# Altium schematic sheet MCU.SchDoc: MCU
size A4; ApprovedBy: Nhatkhongbuon; Author: Nhatkhongbuon; Revision: 1.0; SheetNumber: 2; SheetTotal: 3; ProjectTitle: Mobile Robot
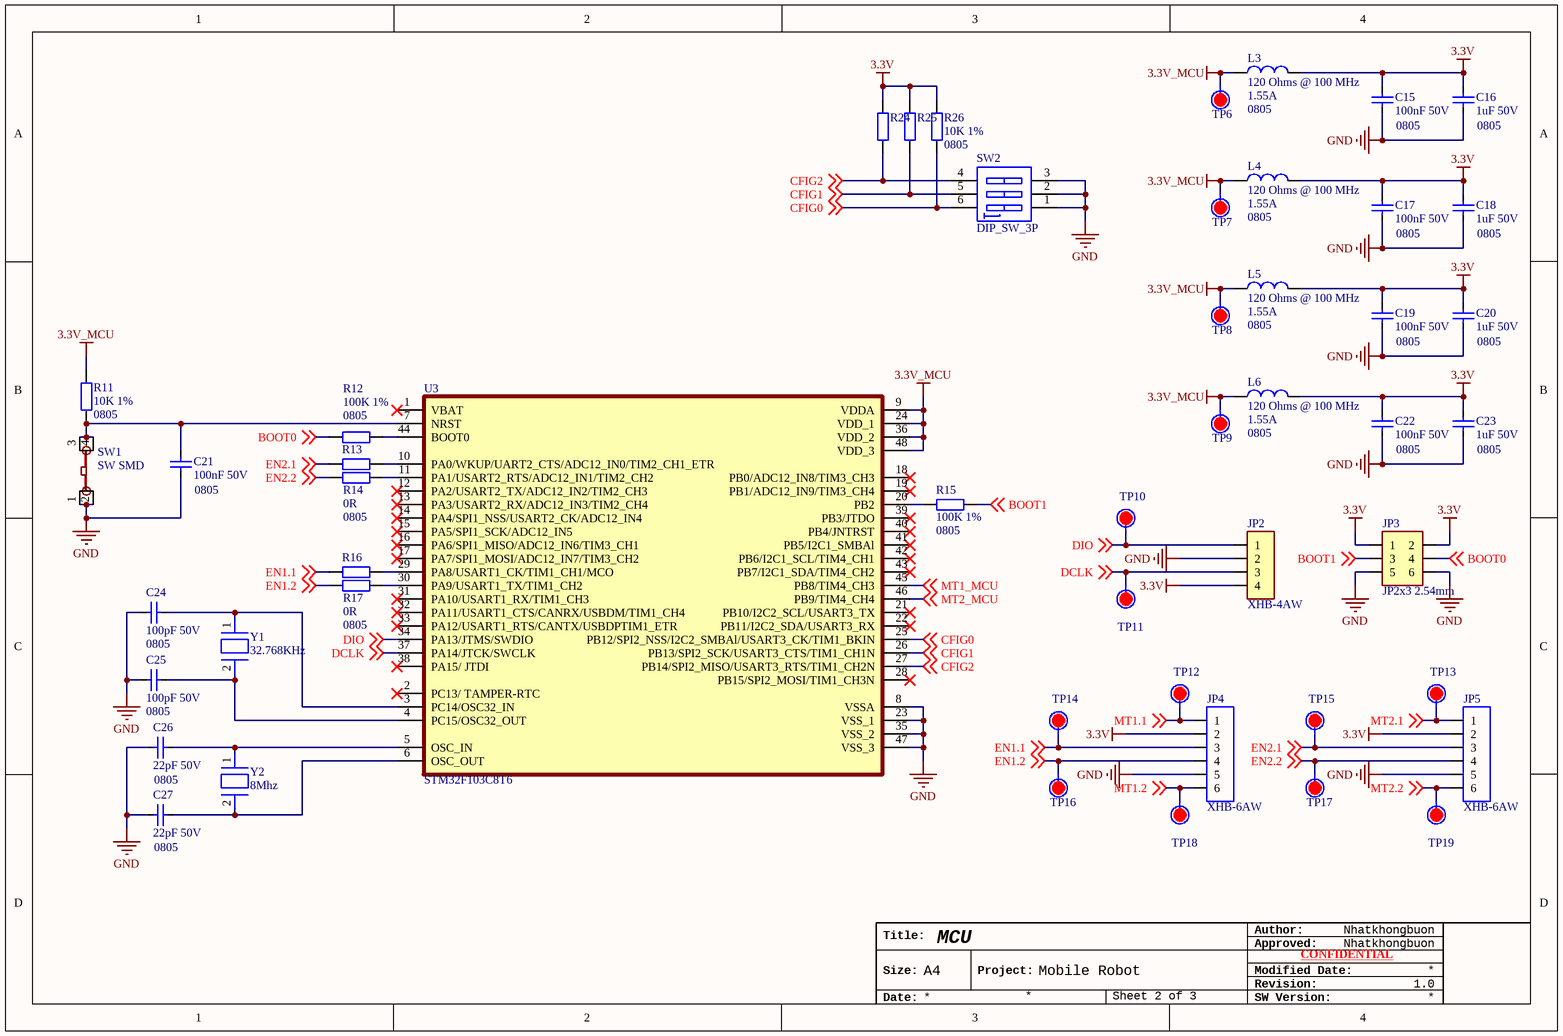
[diagram p0: MCU.SchDoc]

## Parts
C15  100nF 50V  Size: 0805  [CAP_SMD_0805_NEW]
C16  1uF 50V  Size: 0805  [CAP_SMD_0805_NEW]
C17  100nF 50V  Size: 0805  [CAP_SMD_0805_NEW]
C18  1uF 50V  Size: 0805  [CAP_SMD_0805_NEW]
C19  100nF 50V  Size: 0805  [CAP_SMD_0805_NEW]
C20  1uF 50V  Size: 0805  [CAP_SMD_0805_NEW]
C21  100nF 50V  Size: 0805  [CAP_SMD_0805_NEW]
C22  100nF 50V  Size: 0805  [CAP_SMD_0805_NEW]
C23  1uF 50V  Size: 0805  [CAP_SMD_0805_NEW]
C24  100pF 50V  Size: 0805  [CAP_SMD_0805_NEW]
C25  100pF 50V  Size: 0805  [CAP_SMD_0805_NEW]
C26  22pF 50V  Size: 0805  [CAP_SMD_0805_NEW]
C27  22pF 50V  Size: 0805  [CAP_SMD_0805_NEW]
JP2  XHB-4AW  [CONN_XHB-4AW]
JP3  JP2x3 2.54mm  [JP2x3_M]
JP4  XHB-6AW  [XHB-6AW]
JP5  XHB-6AW  [XHB-6AW]
L3  Impedance @ Frequency: 120 Ohms @ 100 MHz  Current: 1.55A  Size: 0805  [FB_0805]  (hidden comment: 120Ohms 100Mhz)
L4  Impedance @ Frequency: 120 Ohms @ 100 MHz  Current: 1.55A  Size: 0805  [FB_0805]  (hidden comment: 120Ohms 100Mhz)
L5  Impedance @ Frequency: 120 Ohms @ 100 MHz  Current: 1.55A  Size: 0805  [FB_0805]  (hidden comment: 120Ohms 100Mhz)
L6  Impedance @ Frequency: 120 Ohms @ 100 MHz  Current: 1.55A  Size: 0805  [FB_0805]  (hidden comment: 120Ohms 100Mhz)
R11  10K 1%  Size: 0805  [RES_SMD_0805]
R12  100K 1%  Size: 0805  [RES_SMD_0805]
R13  0R  [RES_SMD_0805]  (value not drawn)
R14  0R  Size: 0805  [RES_SMD_0805]
R15  100K 1%  Size: 0805  [RES_SMD_0805]
R16  0R  [RES_SMD_0805]  (value not drawn)
R17  0R  Size: 0805  [RES_SMD_0805]
R24  10K 1%  [RES_SMD_0805]  (value not drawn)
R25  10K 1%  [RES_SMD_0805]  (value not drawn)
R26  10K 1%  Size: 0805  [RES_SMD_0805]
SW1  SW SMD  [SMD_6X6X7]
SW2  DIP_SW_3P  [DIPSWITCH3]
TP6  Test Point  [TEST_POINT]  (value not drawn)
TP7  Test Point  [TEST_POINT]  (value not drawn)
TP8  Test Point  [TEST_POINT]  (value not drawn)
TP9  Test Point  [TEST_POINT]  (value not drawn)
TP10  Test Point  [TEST_POINT]  (value not drawn)
TP11  Test Point  [TEST_POINT]  (value not drawn)
TP12  Test Point  [TEST_POINT]  (value not drawn)
TP13  Test Point  [TEST_POINT]  (value not drawn)
TP14  Test Point  [TEST_POINT]  (value not drawn)
TP15  Test Point  [TEST_POINT]  (value not drawn)
TP16  Test Point  [TEST_POINT]  (value not drawn)
TP17  Test Point  [TEST_POINT]  (value not drawn)
TP18  Test Point  [TEST_POINT]  (value not drawn)
TP19  Test Point  [TEST_POINT]  (value not drawn)
U3  STM32F103C8T6  [LQFP-48]
Y1  32.768KHz  [3215_2P]
Y2  8Mhz  [5032_2P]

## Nets
3.3V: C15.2 C16.2 C17.2 C18.2 C19.2 C20.2 C22.2 C23.2 JP2.4 JP3.1 JP3.2 JP4.2 JP5.2 L3.2 L4.2 L5.2 L6.2 R24.1 R25.1 R26.1
3.3V_MCU: L3.1 L4.1 L5.1 L6.1 R11.2 TP6.1 TP7.1 TP8.1 TP9.1 U3.9(VDDA) U3.24(VDD_1) U3.36(VDD_2) U3.48(VDD_3)
GND: C15.1 C16.1 C17.1 C18.1 C19.1 C20.1 C21.1 C22.1 C23.1 C24.1 C25.1 C26.1 C27.1 JP2.2 JP3.5 JP3.6 JP4.5 JP5.5 SW1.1 SW1.2 SW2.1(A1) SW2.2(A2) SW2.3(A3) U3.8(VSSA) U3.23(VSS_1) U3.35(VSS_2) U3.47(VSS_3)
BOOT0: JP3.4 R12.1 ; off-sheet BOOT0
BOOT1: JP3.3 R15.2 ; off-sheet BOOT1
CFIG0: R26.2 SW2.6(B1) U3.25(PB12/SPI2_NSS/I2C2_SMBAl/USART3_CK/TIM1_BKIN) ; off-sheet CFIG0
CFIG1: R25.2 SW2.5(B2) U3.26(PB13/SPI2_SCK/USART3_CTS/TIM1_CH1N) ; off-sheet CFIG1
CFIG2: R24.2 SW2.4(B3) U3.27(PB14/SPI2_MISO/USART3_RTS/TIM1_CH2N) ; off-sheet CFIG2
DCLK: JP2.3 TP11.1 U3.37(PA14/JTCK/SWCLK) ; off-sheet DCLK
DIO: JP2.1 TP10.1 U3.34(PA13/JTMS/SWDIO) ; off-sheet DIO
EN1.1: JP4.3 R16.1 TP14.1 ; off-sheet EN1.1
EN1.2: JP4.4 R17.1 TP16.1 ; off-sheet EN1.2
EN2.1: JP5.3 R13.1 TP15.1 ; off-sheet EN2.1
EN2.2: JP5.4 R14.1 TP17.1 ; off-sheet EN2.2
MT1.1: JP4.1 TP12.1 ; off-sheet MT1.1
MT1.2: JP4.6 TP18.1 ; off-sheet MT1.2
MT1_MCU: U3.45(PB8/TIM4_CH3) ; off-sheet MT1_MCU
MT2.1: JP5.1 TP13.1 ; off-sheet MT2.1
MT2.2: JP5.6 TP19.1 ; off-sheet MT2.2
MT2_MCU: U3.46(PB9/TIM4_CH4) ; off-sheet MT2_MCU
NetC21_2: C21.2 R11.1 SW1.3 SW1.4 U3.7(NRST)
NetC24_2: C24.2 U3.3(PC14/OSC32_IN) Y1.1
NetC25_2: C25.2 U3.4(PC15/OSC32_OUT) Y1.2
NetC26_2: C26.2 U3.5(OSC_IN) Y2.1
NetC27_2: C27.2 U3.6(OSC_OUT) Y2.2
NetR12_2: R12.2 U3.44(BOOT0)
NetR13_2: R13.2 U3.10(PA0/WKUP/UART2_CTS/ADC12_IN0/TIM2_CH1_ETR)
NetR14_2: R14.2 U3.11(PA1/USART2_RTS/ADC12_IN1/TIM2_CH2)
NetR15_1: R15.1 U3.20(PB2)
NetR16_2: R16.2 U3.29(PA8/USART1_CK/TIM1_CH1/MCO)
NetR17_2: R17.2 U3.30(PA9/USART1_TX/TIM1_CH2)

Not connected (* = marked no-connect by the designer): U3 1(VBAT)* 2(PC13/_TAMPER-RTC)* 12(PA2/USART2_TX/ADC12_IN2/TIM2_CH3)* 13(PA3/USART2_RX/ADC12_IN3/TIM2_CH4)* 14(PA4/SPI1_NSS/USART2_CK/ADC12_IN4)* 15(PA5/SPI1_SCK/ADC12_IN5)* 16(PA6/SPI1_MISO/ADC12_IN6/TIM3_CH1)* 17(PA7/SPI1_MOSI/ADC12_IN7/TIM3_CH2)* 18(PB0/ADC12_IN8/TIM3_CH3)* 19(PB1/ADC12_IN9/TIM3_CH4)* 21(PB10/I2C2_SCL/USART3_TX)* 22(PB11/I2C2_SDA/USART3_RX)* 28(PB15/SPI2_MOSI/TIM1_CH3N)* 31(PA10/USART1_RX/TIM1_CH3)* 32(PA11/USART1_CTS/CANRX/USBDM/TIM1_CH4)* 33(PA12/USART1_RTS/CANTX/USBDPTIM1_ETR)* 38(PA15/_JTDI)* 39(PB3/JTDO)* 40(PB4/JNTRST)* 41(PB5/I2C1_SMBAl)* 42(PB6/I2C1_SCL/TIM4_CH1)* 43(PB7/I2C1_SDA/TIM4_CH2)*

## Notes on the sheet
- Author:
- Title:
- Size:
- A4
- Project:
- Approved:
- Revision:
- Modified Date:
- CONFIDENTIAL
- Date:
- SW Version:

## Library data of the parts
C15 C17 C19 C21 C22 = C0805_MLCC_100nF_50V: 0.1 µF ±10% 50V Ceramic Capacitor X7R 0805 (2012 Metric); Manufacturer: YAGEO; Manufacture Part Number: CC0805KRX7R9BB104; Packaging: Cut Tape (CT); Link: https://www.digikey.cn/en/products/detail/yageo/CC0805KRX7R9BB104/302874; Price: $0.10
C16 C18 C20 C23 = C0805_MLCC_1uF_50V: 1 µF ±10% 50V Ceramic Capacitor X7R 0805 (2012 Metric); Manufacturer: Samsung Electro-Mechanics; Manufacture Part Number: CL21B105KBFNNNG; Packaging: Cut Tape (CT); Link: https://www.digikey.cn/en/products/detail/samsung-electro-mechanics/CL21B105KBFNNNG/3894467; Price: $0.11
C24 C25 = C0805_MLCC_100pF_50V: 100 pF ±5% 50V Ceramic Capacitor C0G, NP0 0805 (2012 Metric); Manufacturer: KEMET; Manufacture Part Number: C0805C101J5GAC7800; Packaging: Cut Tape (CT); Link: https://www.digikey.com/en/products/detail/kemet/C0805C101J5GAC7800/411121?s=N4IgTCBcDaIMIAYAcCCscCMCMClUHEBBOAdhQRAF0BfIA; Price: $0.11
C26 C27 = C0805_MLCC_22pF_50V: 22 pF ±1% 250V Ceramic Capacitor C0G, NP0 0805 (2012 Metric); Manufacturer: KYOCERA AVX; Manufacture Part Number: 600F220FT250XT; Packaging: Cut Tape (CT); Link: https://www.digikey.cn/en/products/detail/kyocera-avx/600F220FT250XT/3905100; Price: $2.26
JP2 = XHB-4AW: 1x4P 4P 1 2.5mm 4 Right-Angle Push-Pull,P=2.5mm Wire To Board Connector ROHS; Manufacturer: BOOMELE(Boom Precision Elec); Manufacture Part Number: XHB-4AW; Link: https://www.lcsc.com/product-detail/Wire-To-Board-Connector_BOOMELE-Boom-Precision-Elec-XHB-4AW_C95476.html; Price: $ 0.0230
JP3 = JP2x3M: Direct Insert 6P 2.54mm Double Row Black Plugin,P=2.54mm Pin Headers ROHS; Manufacturer: BOOMELE(Boom Precision Elec); Manufacture Part Number: 2.54-2*3P; Packaging: Bulk; Link: https://www.lcsc.com/product-detail/Pin-Headers_BOOMELE-Boom-Precision-Elec-2-54-2-3P_C65114.html; Price: $ 0.0289
JP4 JP5 = XHB-6AW: 1x6P 6P 1 2.5mm 6 Bend insert Push-Pull,P=2.5mm Wire To Board Connector ROHS; Manufacturer: BOOMELE(Boom Precision Elec); Manufacture Part Number: XHB-6AW; Link: https://www.lcsc.com/product-detail/Wire-To-Board-Connector_BOOMELE-Boom-Precision-Elec-XHB-6AW_C66056.html; Price: $ 0.0334
L3-L6 = FR_120Ohms_100Mhz: Manufacturer: Murata Electronics; Manufacture Part Number: BLM21PG121BH1D; Packaging: Cut Tape (CT); Link: https://www.digikey.cn/en/products/detail/murata-electronics/BLM21PG121BH1D/10702696; Price: $0.18
R11 R24-R26 = R0805_10K: 10 kOhms ±1% 0.125W, 1/8W Chip Resistor 0805 (2012 Metric) Moisture Resistant Thick Film; Manufacturer: YAGEO; Manufacture Part Number: RC0805FR-0710KL; Packaging: Cut Tape (CT); Price: $0.10; Link: https://www.digikey.cn/en/products/detail/yageo/RC0805FR-0710KL/727535
  R24 R25: Size: 0805
R12 R15 = R0805_100K: 100 kOhms ±1% 0.125W, 1/8W Chip Resistor 0805 (2012 Metric) Moisture Resistant Thick Film; Manufacturer: YAGEO; Manufacture Part Number: RC0805FR-07100KL; Packaging: Cut Tape (CT); Link: https://www.digikey.cn/en/products/detail/yageo/RC0805FR-07100KL/727544; Price: $0.10
R13 R14 R16 R17 = R0805_0R: 0 Ohms Jumper Chip Resistor 0805 (2012 Metric) Automotive AEC-Q200 Thick Film; Manufacturer: Vishay Dale; Manufacture Part Number: CRCW08050000Z0EA; Packaging: Cut Tape (CT); Link: https://www.digikey.cn/en/products/detail/vishay-dale/CRCW08050000Z0EA/1175125; Price: $0.10
  R13 R16: Size: 0805
SW1 = SW_SMD_6X6X7: 不带 6mm 7mm 50mA Round Button Brick nogging SPST 6mm 8万次 12V SMD Tactile Switches ROHS; Manufacturer: Shenzhen Kinghelm Elec; Manufacture Part Number: KH-6X6X7H-STM; Link: https://www.lcsc.com/product-detail/Tactile-Switches_Shenzhen-Kinghelm-Elec-KH-6X6X7H-STM_C2837533.html; Price: $ 0.0185
SW2 = DIP_SW_3P: Dip Switch SPST 3 Position Through Hole Slide (Standard) Actuator 25mA 24VDC; Manufacturer: CIT Relay and Switch; Manufacture Part Number: KG03E; Packaging: Tube; Link: https://www.digikey.cn/en/products/detail/cit-relay-and-switch/KG03E/15294176; Price: $0.65
TP6-TP19 = TEST_POINT
U3 = STM32F103C8T6: ARM® Cortex®-M3 STM32F1 Microcontroller IC 32-Bit Single-Core 72MHz 64KB (64K x 8) FLASH; Manufacturer: STMicroelectronics; Manufacture Part Number: STM32F103C8T6; Packaging: Tray; Link: https://www.digikey.cn/en/products/detail/stmicroelectronics/STM32F103C8T6/1646338; Price: $6.11
Y1 = 3215_2P_32.768KHz: 32.768kHz Surface Mount Crystal 12.5pF ±20ppm SMD3215-2P Crystals ROHS; Manufacturer: Yajingxin; Manufacture Part Number: TCXM32768K2NGDCZT2T; VNese Price: 4700; Packaging: Cut Tape; Link: https://www.lcsc.com/product-detail/Crystals_Yajingxin-TCXM32768K2NGDCZT2T_C145167.html; Price: $ 0.1930; Link Shopee: https://linhkien.cxt.vn/2947-fc-135-thach-anh-32768khz-125pf-3215.html
Y2 = 5032_2P_8MHz: 8MHz  20pF ±30ppm ±30ppm SMD5032 Crystals ROHS; Manufacturer: TAITIEN Elec; Manufacture Part Number: XSHEELNANF-16MHZ; VNese Price: 4400; Packaging: Cut Tape; Link: https://www.lcsc.com/product-detail/Crystals_TAITIEN-Elec-XSHEELNANF-8MHZ_C242219.html; Price: $ 0.3251; Link Shopee: https://linhkien.cxt.vn/1388-thach-anh-5032-2-chan-dan.html